# EAGLE design Servo555 (EAGLE 7.2.0)
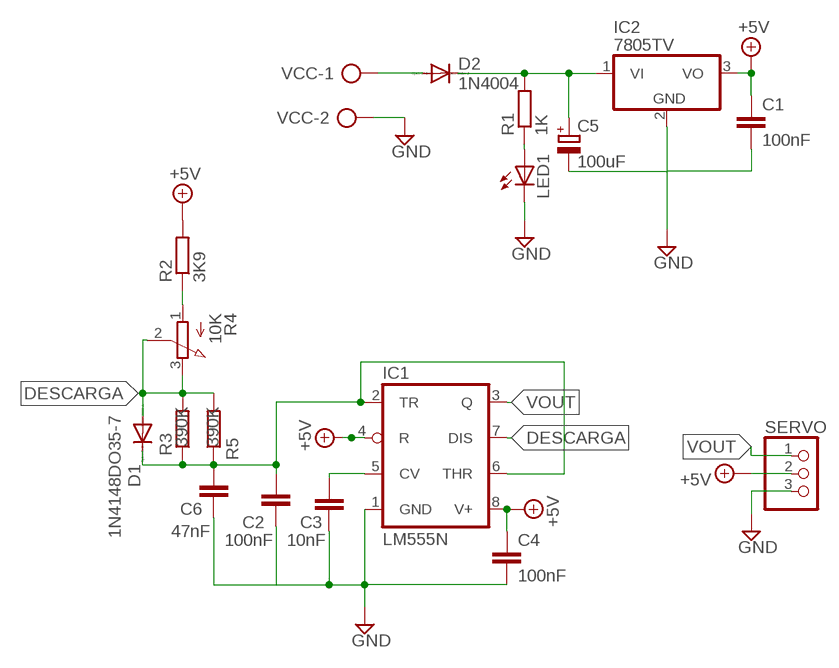
[diagram p0: schematic, sheet 1]

## Parts
C1  100nF  C-EU050-025X075  [C050-025X075]
C2  100nF  C-EU050-025X075  [C050-025X075]
C3  10nF  C-EU050-025X075  [C050-025X075]
C4  100nF  C-EU050-025X075  [C050-025X075]
C5  100uF  CPOL-EUE2.5-7  [E2,5-7]
C6  47nF  C-EU050-025X075  [C050-025X075]
D1  1N4148DO35-7  [DO35-7]
D2  1N4004  [DO41-10]
IC1  LM555N  [DIL08]
IC2  7805TV  [TO220V]
LED1  LED3MM  [LED3MM]
R1  1K  R-EU_0207/7  [0207/7]
R2  3K9  R-EU_0207/7  [0207/7]
R3  390K  R-EU_0207/7  [0207/7]
R4  10K  3RP/1610N  [3RP/1610N]
R5  390K  R-EU_0207/7  [0207/7]
SERVO  PINHD-1X3  [1X03]
VCC  AK500/2  [AK500/2]

## Nets
+5V: C1.1 C4.1 IC1.4(R) IC1.8(V+) IC2.3(VO) R2.2 SERVO.2
DESCARGA: D1.A IC1.7(DIS) R3.2 R4.2(S) R4.3(E) R5.2
GND: C1.2 C2.2 C3.2 C4.2 C5.- C6.2 IC1.1(GND) IC2.2(GND) LED1.K(C) SERVO.3 VCC.2
N$1: D2.A VCC.1
N$2: C5.+ D2.C IC2.1(VI) R1.2
N$3: LED1.A R1.1
N$4: C2.1 C6.1 D1.C IC1.2(TR) IC1.6(THR) R3.1 R5.1
N$8: C3.1 IC1.5(CV)
N$13: R2.1 R4.1(A)
VOUT: IC1.3(Q) SERVO.1

## Library data of the parts
C1-C4 C6 = rcl:C-EU: CAPACITOR, European symbol
C5 = rcl:CPOL-EU: POLARIZED CAPACITOR, European symbol
D1 = diode:1N4148: DIODE high speed (Philips)
D2 = diode:1N4004: DIODE general purpose rectifier, 1 A
IC1 = linear:*555: TIMER
IC2 = linear:78*: Positive VOLTAGE REGULATOR Source: http://cache.national.com/ds/LM/LM78L05.pdf http://www.fairchildsemi.com/ds/LM/LM7805.pdf
LED1 = led:LED: LED OSRAM: - CHIPLED LG R971, LG N971, LY N971, LG Q971, LY Q971, LO R971, LY R971 LH N974, LH R974 LS Q976, LO Q976, LY Q976 LO Q996 - Hyper CHIPLED LW Q18S LB Q993, LB Q99A, LB R99A - SideLED LS A670, LO A670, LY A670, LG A670, LP A670 LB A673, LV A673, LT A673, LW A673 LH A674 LY A675 LS A676, LA A676, LO A676, LY A676, LW A676 LS A679, LY A679, LG A679 - Hyper Micro SIDELED® LS Y876, LA Y876, LO Y876, LY Y876 LT Y87S - SmartLED LW L88C, LW L88S LB L89C, LB L89S, LG L890 LS L89K, LO L89K, LY L89K LS L896, LA L896, LO L896, LY L896 - TOPLED LS T670, LO T670, LY T670, LG T670, LP T670 LSG T670, LSP T670, LSY T670, LOP T670, LYG T670 LG T671, LOG T671, LSG T671 LB T673, LV T673, LT T673, LW T673 LH T674 LS T676, LA T676, LO T676, LY T676, LB T676, LH T676, LSB T676, LW T676 LB T67C, LV T67C, LT T67C, LS T67K, LO T67K, LY T67K, LW E67C LS E67B, LA E67B, LO E67B, LY E67B, LB E67C, LV E67C, LT E67C LW T67C LS T679, LY T679, LG T679 LS T770, LO T770, LY T770, LG T770, LP T770 LB T773, LV T773, LT T773, LW T773 LH T774 LS E675, LA E675, LY E675, LS T675 LS T776, LA T776, LO T776, LY T776, LB T776 LHGB T686 LT T68C, LB T68C - Hyper Mini TOPLED® LB M676 - Mini TOPLED Santana® LG M470 LS M47K, LO M47K, LY M47K Source: http://www.osram.convergy.de LUXEON: - LUMILED® LXK2-PW12-R00, LXK2-PW12-S00, LXK2-PW14-U00, LXK2-PW14-V00 LXK2-PM12-R00, LXK2-PM12-S00, LXK2-PM14-U00 LXK2-PE12-Q00, LXK2-PE12-R00, LXK2-PE12-S00, LXK2-PE14-T00, LXK2-PE14-U00 LXK2-PB12-K00, LXK2-PB12-L00, LXK2-PB12-M00, LXK2-PB14-N00, LXK2-PB14-P00, LXK2-PB14-Q00 LXK2-PR12-L00, LXK2-PR12-M00, LXK2-PR14-Q00, LXK2-PR14-R00 LXK2-PD12-Q00, LXK2-PD12-R00, LXK2-PD12-S00 LXK2-PH12-R00, LXK2-PH12-S00 LXK2-PL12-P00, LXK2-PL12-Q00, LXK2-PL12-R00 Source: www.luxeon.com KINGBRIGHT: KA-3528ASYC Source: www.kingbright.com
R1-R3 R5 = resistor:R-EU_: RESISTOR, European symbol
R4 = pot:3RP/1610N: 16mm Potentiometer one level Source: http://www.alphapotentiometers.net/html/16mm_pot_2.html
SERVO = pinhead:PINHD-1X3: PIN HEADER
VCC = con-ptr500:AK500/2: CONNECTOR; OC_FARNELL: unknown; OC_NEWARK: unknown

## Board
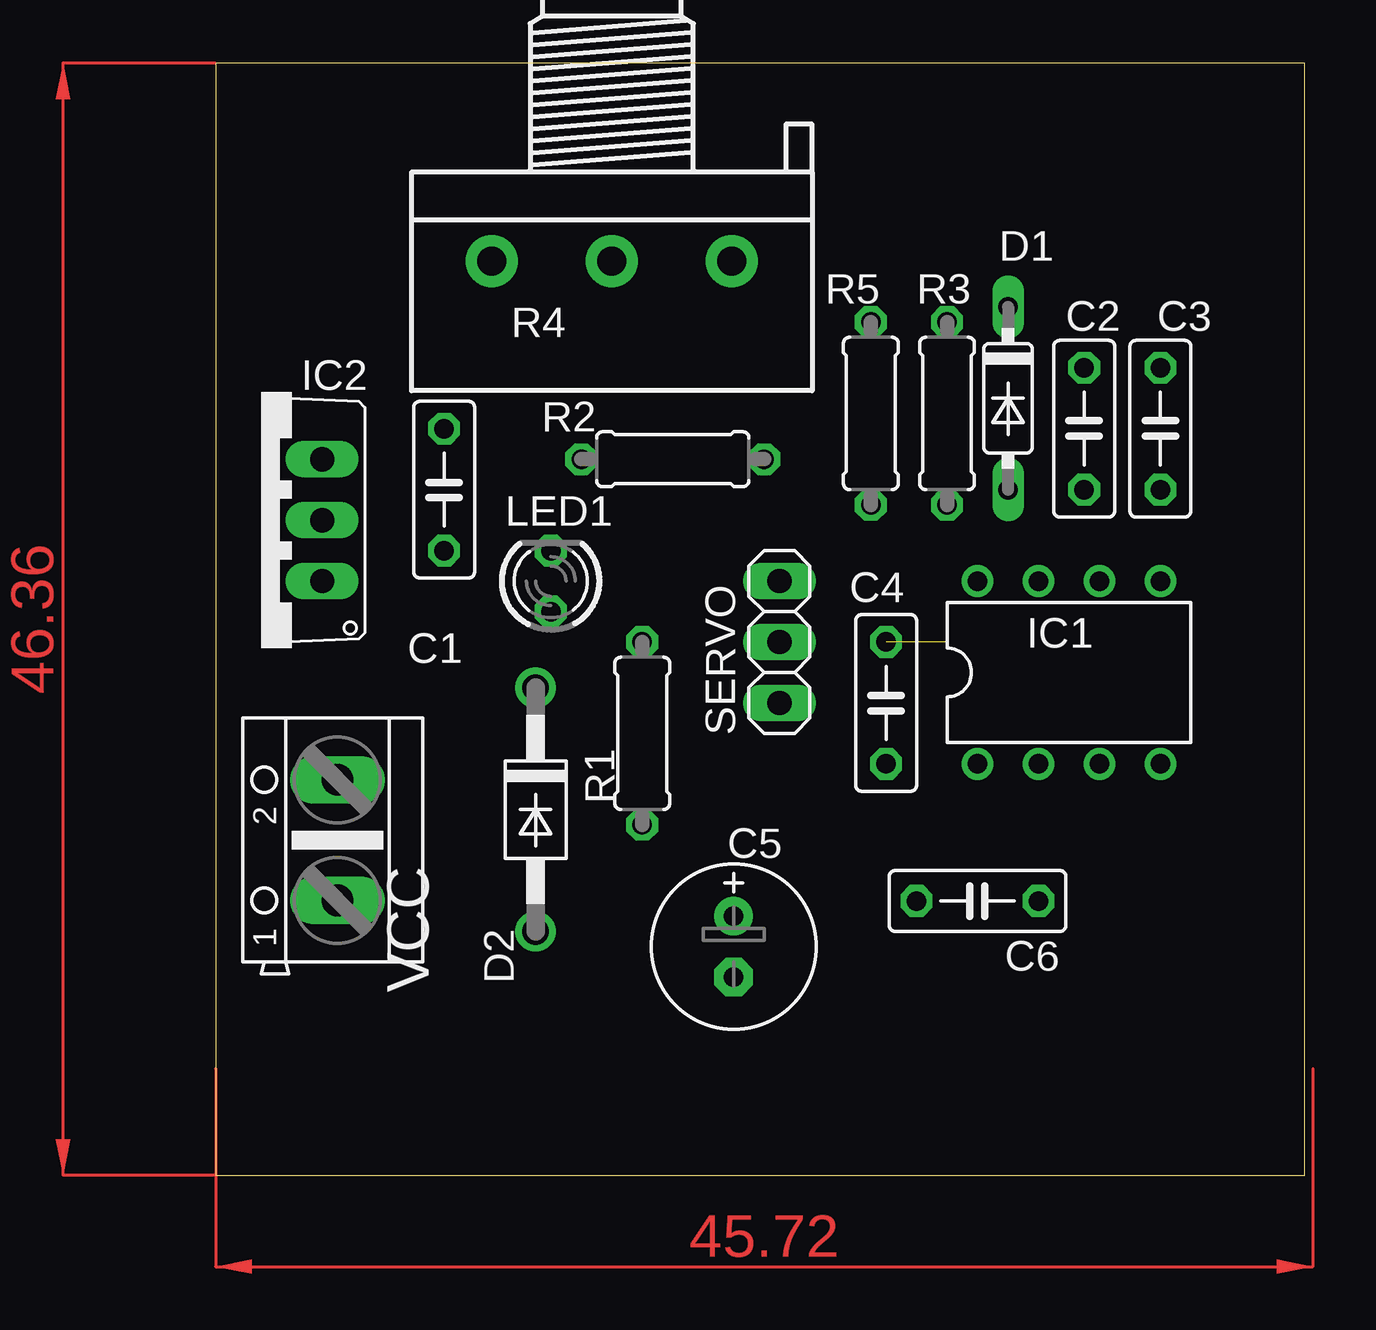
[diagram p1: board, top side]
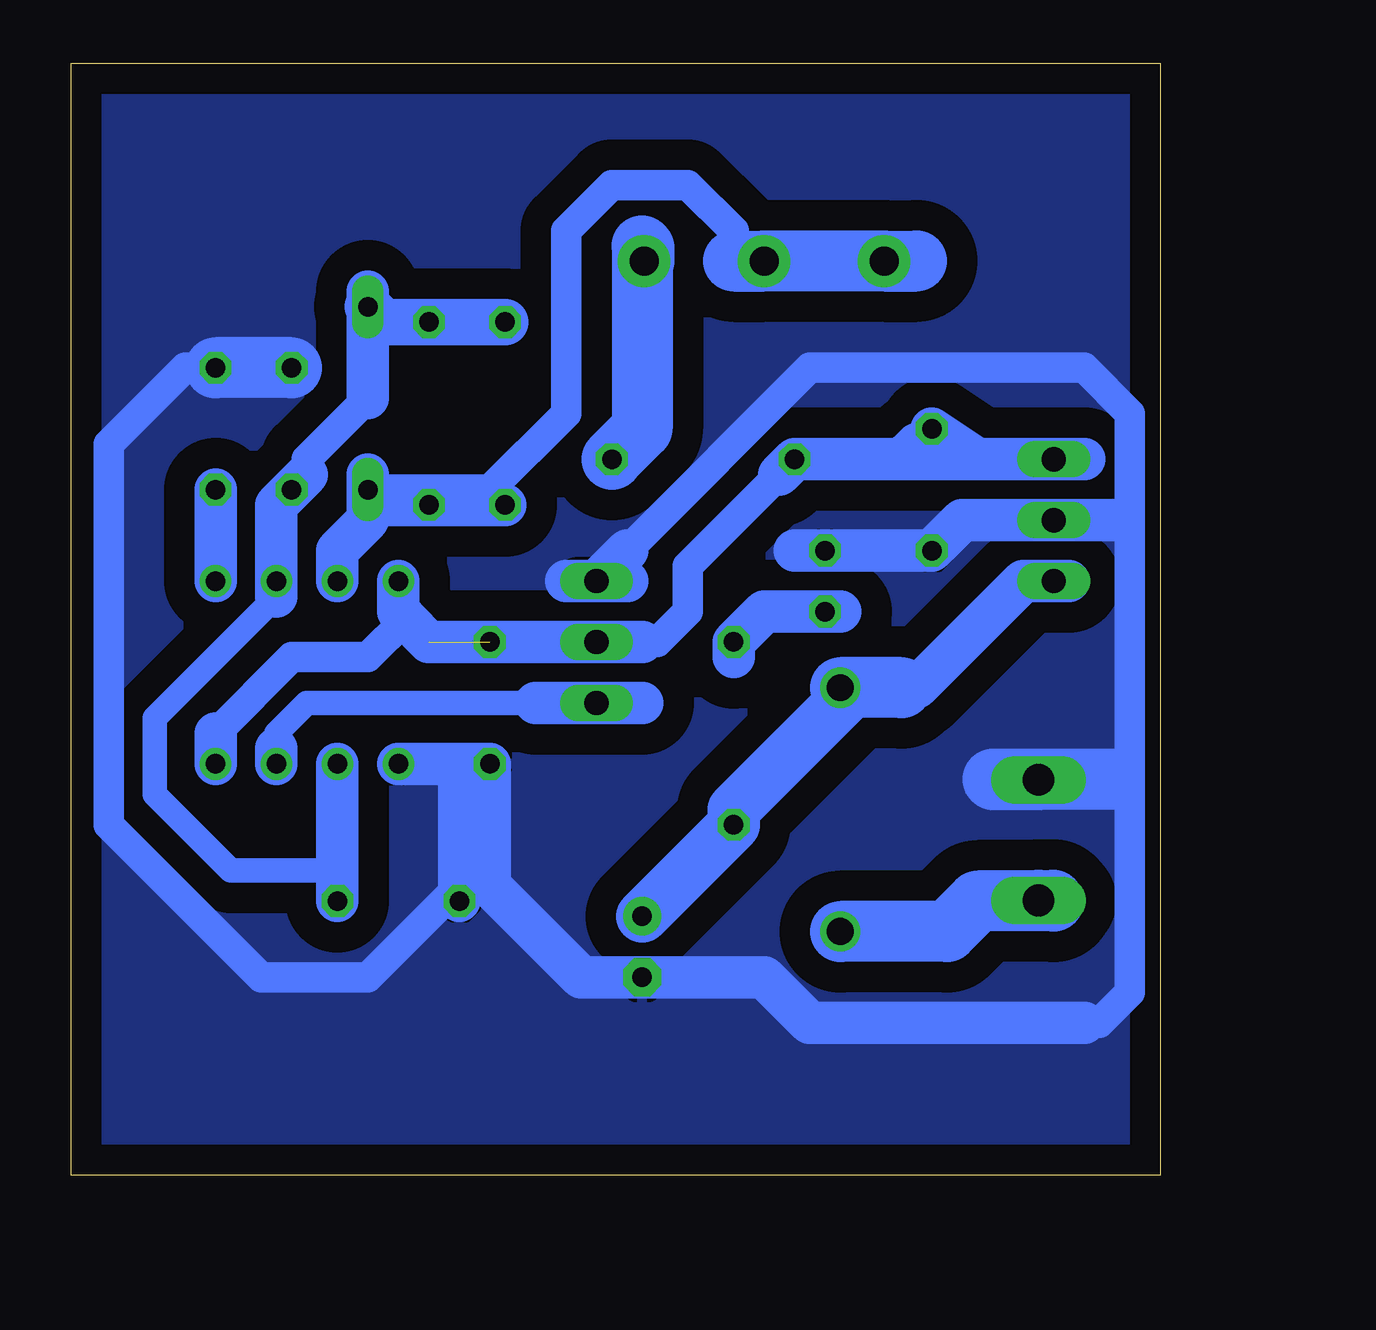
[diagram p2: board, bottom side, seen from below]

Size 45.39 x 46.34 mm. Coordinates in mm from the lower left corner, seen from the top.
Outline: 0,0 45.39,0 45.39,46.34 0,46.34 0,0
Copper layers (1*16): Top 0.035mm / dielectric 1.5mm / Bottom 0.035mm
Design rules "default": minimum track width 10mil, minimum drill 24mil, track to track 8mil, track to pad 8mil, pad to pad 8mil, via to via 8mil, smd to smd 8mil, copper to edge 40mil, drill to drill 8mil, minimum pad ring 10mil, minimum via ring 8mil, stop-mask expansion 4mil, vias tented up to drill 0mil, thermal gap 10mil

### Footprints (pad centres in the part's own frame; a part is rotated, then mirrored left to right if it is on the bottom)
C050-025X075 = drill 0.813 octagon: 1 -2.54,0; 2 2.54,0
E2,5-7 = drill 0.813 pad 1.6: + -1.27,0 | drill 0.813 pad 1.6 octagon: - 1.27,0
DO35-7 = drill 0.813 long: A 3.81,0; C -3.81,0
DO41-10 = drill 1.118: A 5.08,0; C -5.08,0
DIL08 = drill 0.813 pad 1.27: 1 -3.81,-3.81; 2 -1.27,-3.81; 3 1.27,-3.81; 4 3.81,-3.81; 5 3.81,3.81; 6 1.27,3.81; 7 -1.27,3.81; 8 -3.81,3.81
TO220V = drill 1.016 long: 1 -2.54,-2.54; 2 0,-2.54; 3 2.54,-2.54
LED3MM = drill 0.813 octagon: A -1.27,0; K 1.27,0
0207/7 = drill 0.813 octagon: 1 -3.81,0; 2 3.81,0
3RP/1610N = drill 1.2 pad 2.184: 1 -5,0; 2 0,0; 3 5,0
1X03 = drill 1.016 long: 1 -2.54,0; 2 0,0; 3 2.54,0
AK500/2 = drill 1.321 long: 1 -2.515,0; 2 2.515,0

### Placement (x,y rotation side)
C1  9.53,28.57 270 top
C2  36.2,31.12 90 top
C3  39.37,31.12 90 top
C4  27.94,19.69 270 top
C5  21.59,9.52 270 top
C6  31.75,11.43 180 top
D1  33.02,32.38 270 top
D2  13.34,15.24 270 top
IC1  35.56,20.96 0 top
IC2  1.91,27.3 90 top
LED1  13.97,24.77 90 top
R1  17.78,18.41 270 top
R2  19.05,29.84 180 top
R3  30.48,31.75 270 top
R4  16.51,38.1 180 top
R5  27.3,31.75 270 top
SERVO  23.5,22.23 90 top
VCC  5.08,13.97 90 top

### Tracks (layer width: path | path; a pad name or v marks a point on that pad's centre or on a via)
+5V  (1 unrouted)
  Bottom 0.813: SERVO.2 22.86,22.23
  Bottom 1.27: 39.37,18.41 36.2,21.59 33.02,21.59 31.43,23.18 | 15.88,29.21 19.68,25.4 19.68,23.5 20.95,22.23 21.59,22.23
  Bottom 1.778: IC1.8 31.75,23.5 31.43,23.18 30.48,22.23 SERVO.2 21.59,22.23 | IC1.4 39.37,18.41 | 3.17,29.84 IC2.3 7.62,29.84 | 7.62,29.84 C1.1 | 10.79,29.84 R2.2 15.88,29.21 | 10.16,30.48 10.79,29.84 | 10.79,29.84 7.62,29.84
DESCARGA
  Bottom 1.27: 17.78,38.1 17.78,39.37 19.68,41.27 22.86,41.27 24.77,39.37 24.77,31.75 27.94,28.57 D1.A
  Bottom 1.778: IC1.7 34.29,26.04 33.02,27.3 D1.A | 33.02,29.21 D1.A | D1.A 32.38,27.94 R3.2 R5.2
  Bottom 2.54: 10.16,38.1 R4.3 R4.2 17.78,38.1
GND
  Bottom 1.27: 22.23,26.04 14.61,33.66 3.17,33.66 1.27,31.75 1.27,27.3 | 1.91,27.3 1.27,27.3 | 3.17,6.35 2.54,6.35 1.27,7.62 1.27,16.51 | 1.27,16.51 1.27,27.3 | 1.91,16.51 1.27,16.51 | C2.2 40.64,33.66 43.81,30.48 43.81,14.61 37.47,8.25 33.02,8.25 29.21,12.07
  Bottom 1.778: 15.24,26.04 LED1.K C1.2 8.26,27.3 IC2.2 1.91,27.3 | SERVO.3 24.77,24.77 | 22.23,24.77 SERVO.3 | SERVO.3 22.23,26.04 | 3.17,6.35 14.61,6.35 16.51,8.25 C5.- 24.13,8.25 27.94,12.07 C4.2 29.21,17.14 | IC1.1 29.21,17.14 | C6.2 29.21,12.07 29.21,17.14
  Bottom 2.54: C2.2 C3.2 | VCC.2 6.96,16.48 6.99,16.51 1.91,16.51
  pour Bottom (isolate 1.27): 0,0 0,46.36 45.72,46.36 45.72,0
N$1
  Bottom 2.54: VCC.1 4.47,11.45 4.45,11.43 7.62,11.43 8.89,10.16 D2.A
N$2
  Bottom 1.778: 3.81,24.77 IC2.1 5.71,24.77 10.16,20.32 10.79,20.32
  Bottom 2.184: D2.C 12.7,20.32 17.78,15.24 R1.2 C5.+
  Bottom 2.54: 10.79,20.32 D2.C
N$3
  Bottom 1.778: 17.78,21.59 R1.1 16.51,23.5 LED1.A 13.34,23.5
N$4
  Bottom 1.016: 36.83,24.13 41.91,19.05 41.91,15.88 38.73,12.7 34.29,12.7
  Bottom 1.27: 35.56,29.21 35.56,29.84 33.02,32.38
  Bottom 1.778: 35.56,29.21 C2.1 36.83,27.94 IC1.6 36.83,24.13 | 33.02,32.38 D1.C 33.02,36.83 | IC1.2 34.29,12.7 C6.1
  Bottom 1.93: R5.1 R3.1 32.38,35.56 D1.C
N$8
  Bottom 1.778: IC1.5 C3.1
N$13
  Bottom 2.54: R4.1 21.51,38.66 21.59,38.73 21.59,31.12 R2.1
VOUT
  Bottom 1.016: 36.83,17.78 36.83,18.41 35.56,19.69 26.04,19.69
  Bottom 1.778: IC1.3 36.83,17.78 | 26.04,19.69 SERVO.1 21.59,19.69
(copper drawn outside any net)
  shapes: Top area x2